# Altium schematic sheet Schematics Block diagram.SchDoc
size A; SheetNumber: 1; SheetTotal: 1
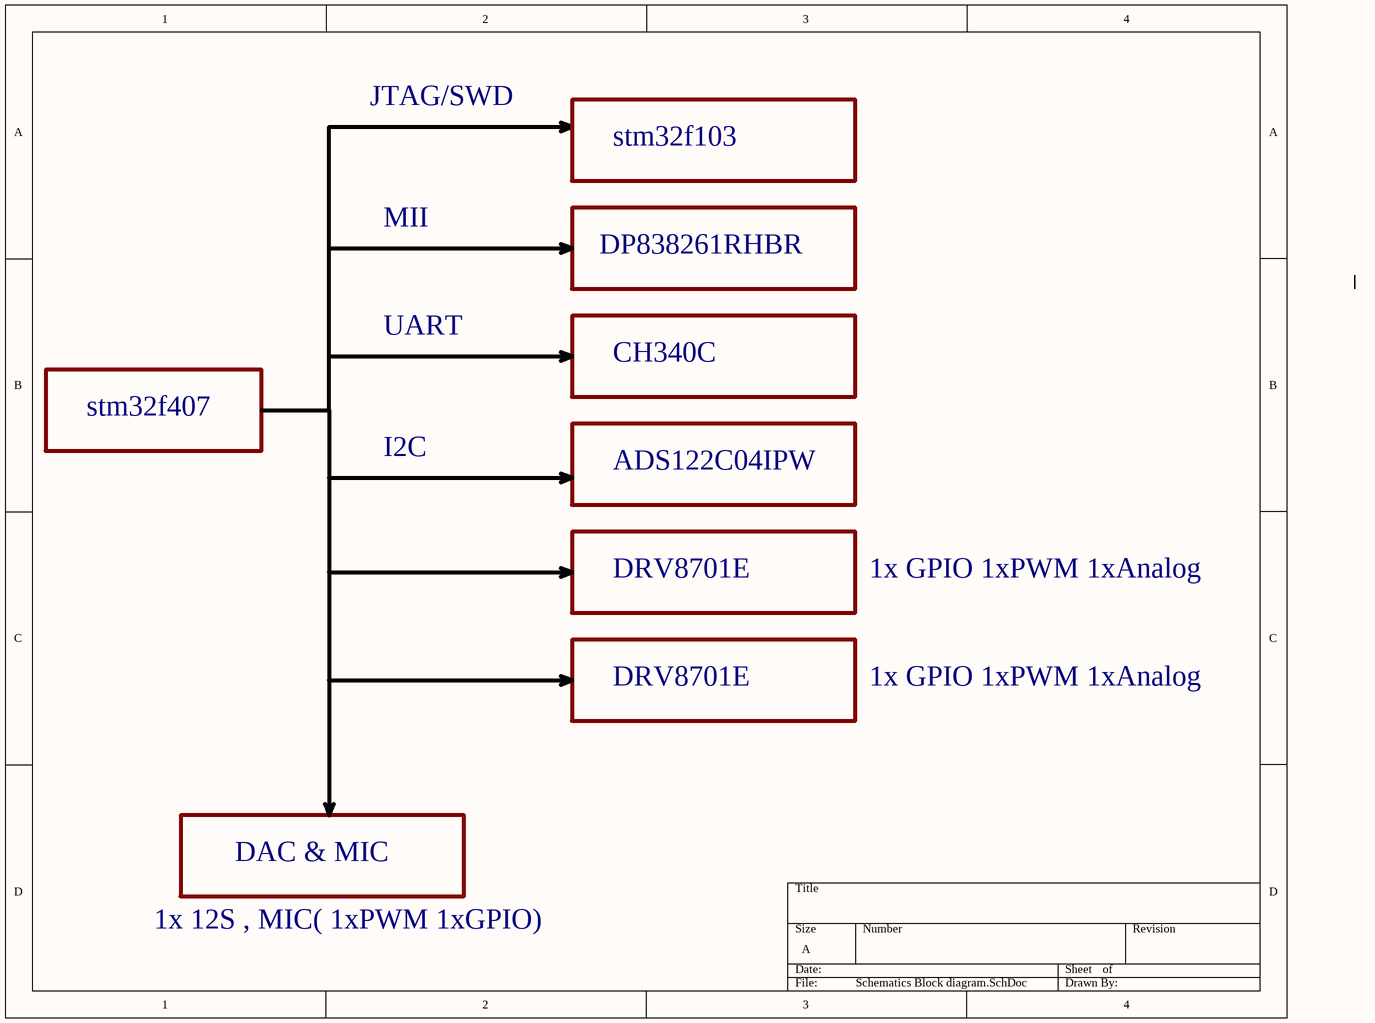
[diagram p0: Schematics Block diagram.SchDoc]

## Notes on the sheet
- JTAG/SWD
- stm32f103
- MII
- DP838261RHBR
- UART
- CH340C
- stm32f407
- I2C
- ADS122C04IPW
- DRV8701E
- 1x GPIO 1xPWM 1xAnalog
- DAC & MIC
- 1x 12S , MIC( 1xPWM 1xGPIO)